# Altium schematic sheet Sheet1.SchDoc
size A4
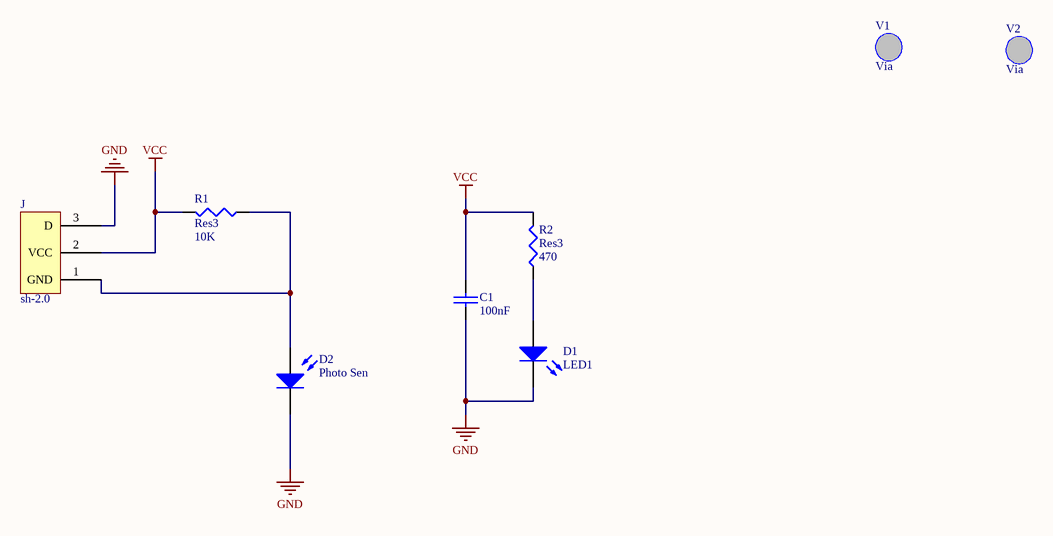
[diagram p0: Sheet1.SchDoc]

## Parts
C1  100nF  [1608[0603]]
D1  LED1  [LED]
D2  Photo Sen  [Q]
J  sh-2.0  [sh-2.0]
R1  Res3  value 10K  [1608[0603]]
R2  Res3  value 470  [1608[0603]]
V1  Via  [Via]
V2  Via  [Via]

## Nets
GND: C1.2 D1.2(K) D2.2(K) J.3(D)
VCC: C1.1 J.2(VCC) R1.2 R2.2
NetD1_1: D1.1(A) R2.1
NetD2_1: D2.1(A) J.1(GND) R1.1

## Library data of the parts
C1 = CAP
D1 = LED1: Typical RED GaAs LED; Published: 8-Jun-2000; LatestRevisionDate: 08-Jul-2005; LatestRevisionNote: Mech Layer 1 removed.; PackageReference: LED-1; Publisher: Altium Limited; PackageDescription: LED; 2 Leads
D2 = Photo Sen: Photosensitive Diode; Published: 24-Mar-1999; LatestRevisionDate: 17-Jul-2002; LatestRevisionNote: Re-released for DXP Platform.; PackageReference: PIN2; Publisher: Altium Limited
R1 R2 = Res3: Resistor; Published: 8-Jun-2000; LatestRevisionDate: 29-May-2009; LatestRevisionNote: IPC-7351 Footprint Added.; PackageReference: J1-0603; Publisher: Altium Limited; PackageDescription: Chip Resistor